# EAGLE design Principal (EAGLE 7.6.0)
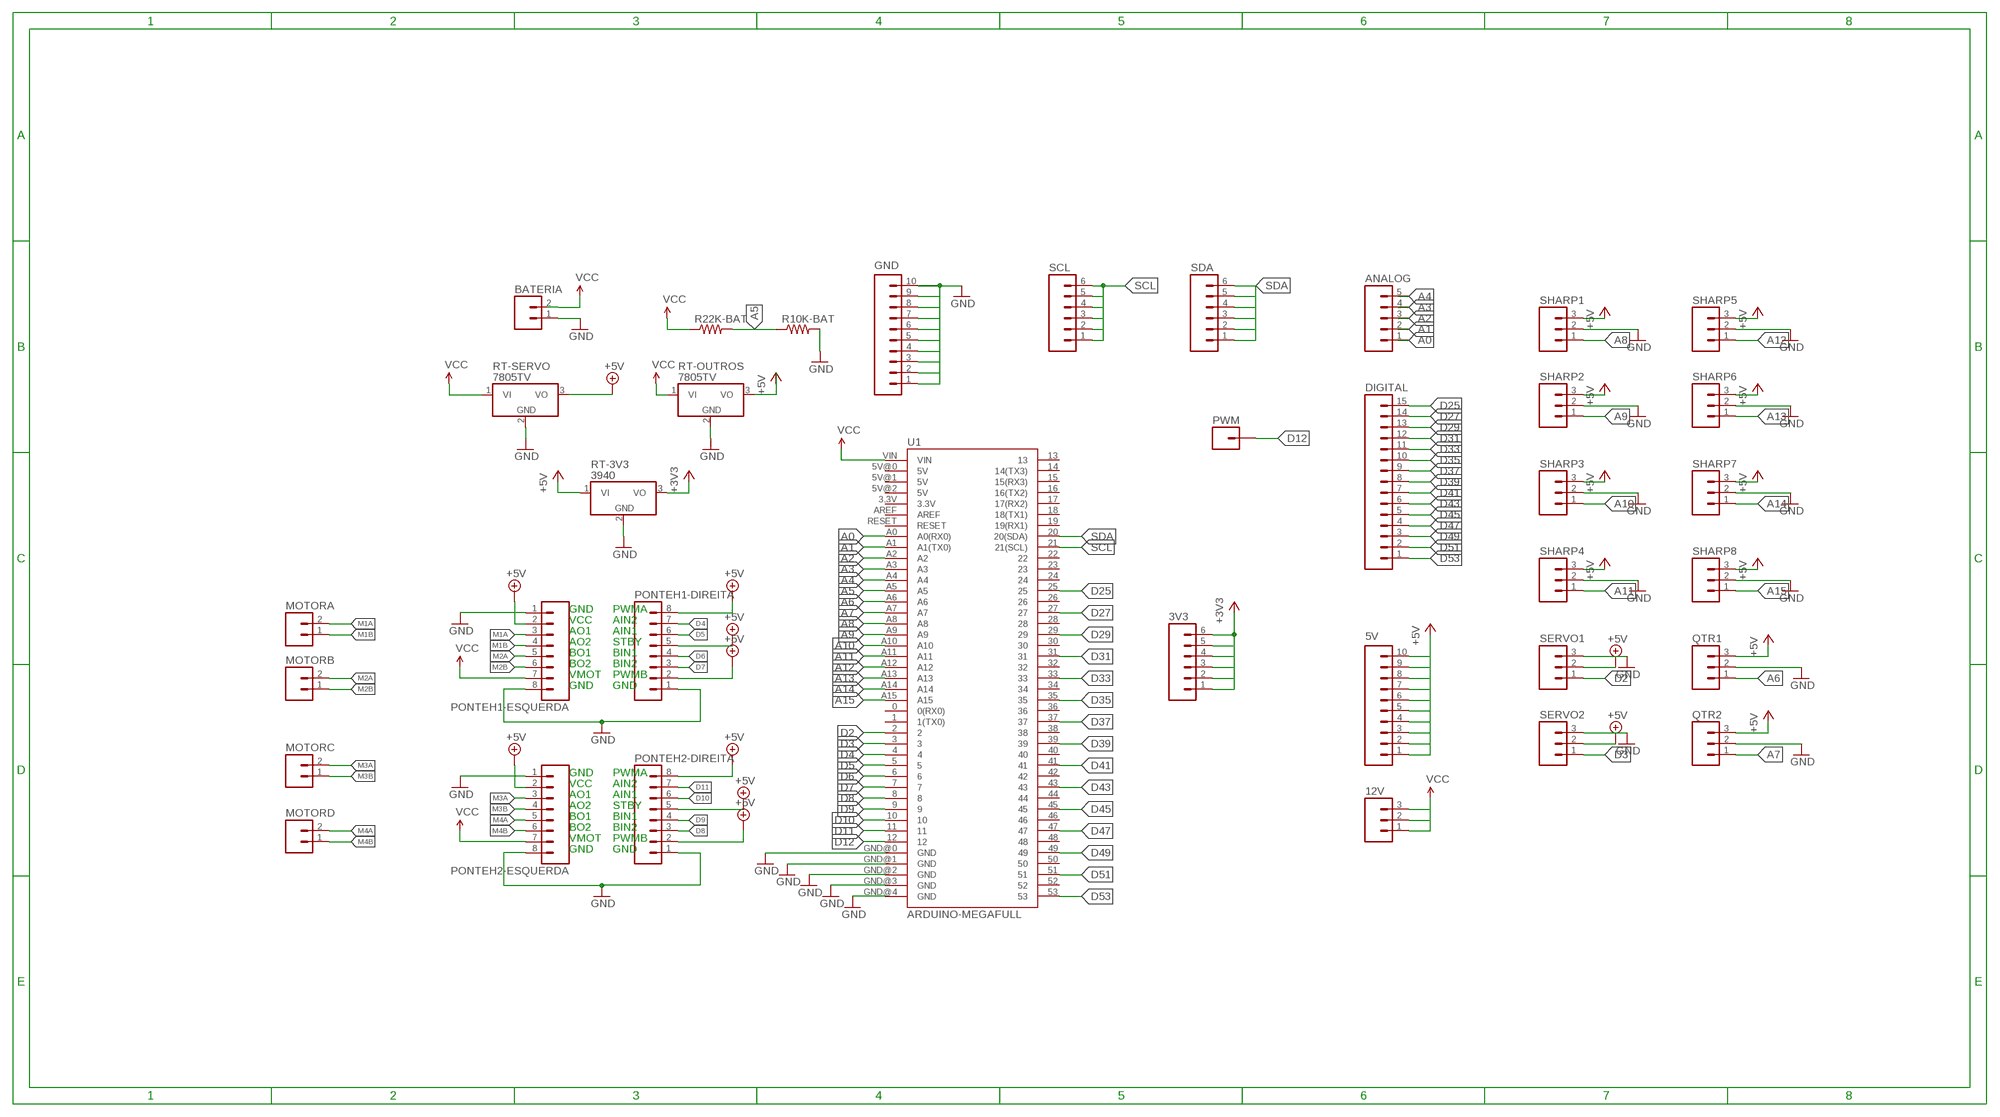
[diagram p0: schematic, sheet 1]

## Parts
3V3  M06SILK_FEMALE_PTH  [1X06]
5V  M10SILK_FEMALE_PTH  [1X10]
12V  M03PTH  [1X03]
ANALOG  M05PTH  [1X05]
BATERIA  M02PTH  [1X02]
DIGITAL  M15  [1X15]
GND  M10SILK_FEMALE_PTH  [1X10]
MOTORA  M02PTH  [1X02]
MOTORB  M02PTH  [1X02]
MOTORC  M02PTH  [1X02]
MOTORD  M02PTH  [1X02]
PONTEH1-DIREITA  M08  [1X08_ROUND]
PONTEH1-ESQUERDA  M08  [1X08_ROUND]
PONTEH2-DIREITA  M08  [1X08_ROUND]
PONTEH2-ESQUERDA  M08  [1X08_ROUND]
PWM  M01PTH  [1X01]
QTR1  M03PTH  [1X03]
QTR2  M03PTH  [1X03]
R10K-BAT  RESISTORPTH-1/4W  [AXIAL-0.4]
R22K-BAT  RESISTORPTH-1/4W  [AXIAL-0.4]
RT-3V3  3940  7805TV  [TO220V]
RT-OUTROS  7805TV  [TO220V]
RT-SERVO  7805TV  [TO220V]
SCL  M06SILK_FEMALE_PTH  [1X06]
SDA  M06SILK_FEMALE_PTH  [1X06]
SERVO1  M03PTH  [1X03]
SERVO2  M03PTH  [1X03]
SHARP1  M03PTH  [1X03]
SHARP2  M03PTH  [1X03]
SHARP3  M03PTH  [1X03]
SHARP4  M03PTH  [1X03]
SHARP5  M03PTH  [1X03]
SHARP6  M03PTH  [1X03]
SHARP7  M03PTH  [1X03]
SHARP8  M03PTH  [1X03]
U1  ARDUINO-MEGAFULL  [ARDUINO_MEGA]

## Nets
3V3: 3V3.2 3V3.3 3V3.4 3V3.5 RT-3V3.3(VO) ; supply symbol labelled +3V3
5V: 5V.2 5V.3 5V.4 5V.5 5V.6 5V.7 5V.8 5V.9 5V.10 RT-OUTROS.3(VO) ; supply symbol labelled +5V
+3V3: 3V3.1 3V3.6
+5V: 5V.1 PONTEH1-DIREITA.2 PONTEH1-DIREITA.5 PONTEH1-DIREITA.8 PONTEH1-ESQUERDA.2 PONTEH2-DIREITA.2 PONTEH2-DIREITA.5 PONTEH2-DIREITA.8 PONTEH2-ESQUERDA.2 QTR1.3 QTR2.3 RT-3V3.1(VI) RT-SERVO.3(VO) SERVO1.2 SERVO2.2 SHARP1.3 SHARP2.3 SHARP3.3 SHARP4.3 SHARP5.3 SHARP6.3 SHARP7.3 SHARP8.3
A0: ANALOG.1 U1.A0(A0(RX0))
A1: ANALOG.2 U1.A1(A1(TX0))
A2: ANALOG.3 U1.A2
A3: ANALOG.4 U1.A3
A4: ANALOG.5 U1.A4
A5: R10K-BAT.P$1 R22K-BAT.P$2 U1.A5
A6: QTR1.1 U1.A6
A7: QTR2.1 U1.A7
A8: SHARP1.1 U1.A8
A9: SHARP2.1 U1.A9
A10: SHARP3.1 U1.A10
A11: SHARP4.1 U1.A11
A12: SHARP5.1 U1.A12
A13: SHARP6.1 U1.A13
A14: SHARP7.1 U1.A14
A15: SHARP8.1 U1.A15
D2: SERVO1.1 U1.2
D3: SERVO2.1 U1.3
D4: PONTEH1-DIREITA.7 U1.4
D5: PONTEH1-DIREITA.6 U1.5
D6: PONTEH1-DIREITA.4 U1.6
D7: PONTEH1-DIREITA.3 U1.7
D8: PONTEH2-DIREITA.3 U1.8
D9: PONTEH2-DIREITA.4 U1.9
D10: PONTEH2-DIREITA.6 U1.10
D11: PONTEH2-DIREITA.7 U1.11
D12: PWM.1 U1.12
D25: DIGITAL.15 U1.25
D27: DIGITAL.14 U1.27
D29: DIGITAL.13 U1.29
D31: DIGITAL.12 U1.31
D33: DIGITAL.11 U1.33
D35: DIGITAL.10 U1.35
D37: DIGITAL.9 U1.37
D39: DIGITAL.8 U1.39
D41: DIGITAL.7 U1.41
D43: DIGITAL.6 U1.43
D45: DIGITAL.5 U1.45
D47: DIGITAL.4 U1.47
D49: DIGITAL.3 U1.49
D51: DIGITAL.2 U1.51
D53: DIGITAL.1 U1.53
GND: BATERIA.1 GND.1 GND.10 PONTEH1-DIREITA.1 PONTEH1-ESQUERDA.1 PONTEH1-ESQUERDA.8 PONTEH2-DIREITA.1 PONTEH2-ESQUERDA.1 PONTEH2-ESQUERDA.8 QTR1.2 QTR2.2 R10K-BAT.P$2 RT-3V3.2(GND) RT-OUTROS.2(GND) RT-SERVO.2(GND) SERVO1.3 SERVO2.3 SHARP1.2 SHARP2.2 SHARP3.2 SHARP4.2 SHARP5.2 SHARP6.2 SHARP7.2 SHARP8.2 U1.GND@0(GND) U1.GND@1(GND) U1.GND@2(GND) U1.GND@3(GND) U1.GND@4(GND)
M1A: MOTORA.2 PONTEH1-ESQUERDA.3
M1B: MOTORA.1 PONTEH1-ESQUERDA.4
M2A: MOTORB.2 PONTEH1-ESQUERDA.5
M2B: MOTORB.1 PONTEH1-ESQUERDA.6
M3A: MOTORC.2 PONTEH2-ESQUERDA.3
M3B: MOTORC.1 PONTEH2-ESQUERDA.4
M4A: MOTORD.2 PONTEH2-ESQUERDA.5
M4B: MOTORD.1 PONTEH2-ESQUERDA.6
N$2: GND.9
N$3: GND.8
N$4: GND.7
N$5: GND.6
N$6: GND.5
N$7: GND.4
N$8: GND.3
N$9: GND.2
SCL: SCL.1 SCL.2 SCL.3 SCL.4 SCL.5 SCL.6 U1.21(21(SCL))
SDA: SDA.1 SDA.2 SDA.3 SDA.4 SDA.5 SDA.6 U1.20(20(SDA))
VCC: 12V.1 12V.2 12V.3 BATERIA.2 PONTEH1-ESQUERDA.7 PONTEH2-ESQUERDA.7 R22K-BAT.P$1 RT-OUTROS.1(VI) RT-SERVO.1(VI) U1.VIN
Unconnected: U1.0(0(RX0)) U1.1(1(TX0)) U1.3.3V U1.5V@0(5V) U1.5V@1(5V) U1.5V@2(5V) U1.13 U1.14(14(TX3)) U1.15(15(RX3)) U1.16(16(TX2)) U1.17(17(RX2)) U1.18(18(TX1)) U1.19(19(RX1)) U1.22 U1.23 U1.24 U1.26 U1.28 U1.30 U1.32 U1.34 U1.36 U1.38 U1.40 U1.42 U1.44 U1.46 U1.48 U1.50 U1.52 U1.AREF U1.RESET

## Notes on the sheet
- GND | PWMA
- VCC | AIN2
- AO1 | AIN1
- AO2 | STBY
- BO1 | BIN1
- BO2 | BIN2
- VMOT | PWMB
- GND | GND
- GND | PWMA
- VCC | AIN2
- AO1 | AIN1
- AO2 | STBY
- BO1 | BIN1
- BO2 | BIN2
- VMOT | PWMB
- GND | GND

## Library data of the parts
3V3 SCL SDA = SparkFun-Connectors:M06: Header 6 Standard 6-pin 0.1" header. Use with straight break away headers (SKU : PRT-00116), right angle break away headers (PRT-00553), swiss pins (PRT-00743), machine pins (PRT-00117), and female headers (PRT-00115). Molex polarized connector foot print use with SKU : PRT-08094 with associated crimp pins and housings. NOTES ON THE VARIANTS LOCK and LOCK_LONGPADS... This footprint was designed to help hold the alignment of a through-hole component (i.e. 6-pin header) while soldering it into place. You may notice that each hole has been shifted either up or down by 0.005 of an inch from it's more standard position (which is a perfectly straight line). This slight alteration caused the pins (the squares in the middle) to touch the edges of the holes. Because they are alternating, it causes a "brace" to hold the component in place. 0.005 has proven to be the perfect amount of "off-center" position when using our standard breakaway headers. Although looks a little odd when you look at the bare footprint, once you have a header in there, the alteration is very hard to notice. Also,if you push a header all the way into place, it is covered up entirely on the bottom side. This idea of altering the position of holes to aid alignment will be further integrated into the Sparkfun Library for other footprints. It can help hold any component with 3 or more connection pins.; PROD_ID: CONN-08437
5V GND = SparkFun-Connectors:M10: Header 10 Standard 10-pin 0.1" header. Use with straight break away headers (SKU : PRT-00116), right angle break away headers (PRT-00553), swiss pins (PRT-00743), machine pins (PRT-00117), and female headers (PRT-00115).; PROD_ID: CONN-11563
12V QTR1 QTR2 SERVO1 SERVO2 SHARP1-SHARP8 = SparkFun-Connectors:M03: Header 3 Standard 3-pin 0.1" header. Use with straight break away headers (SKU : PRT-00116), right angle break away headers (PRT-00553), swiss pins (PRT-00743), machine pins (PRT-00117), and female headers (PRT-00115). Molex polarized connector foot print use with SKU : PRT-08232 with associated crimp pins and housings.
ANALOG = SparkFun-Connectors:M05: Header 5 Standard 5-pin 0.1" header. Use with straight break away headers (SKU : PRT-00116), right angle break away headers (PRT-00553), swiss pins (PRT-00743), machine pins (PRT-00117), and female headers (PRT-00115). Molex polarized connector foot print use with SKU : PRT-08230 with associated crimp pins and housings.
BATERIA MOTORA MOTORB MOTORC MOTORD = SparkFun-Connectors:M02: Standard 2-pin 0.1" header. Use with - straight break away headers ( PRT-00116) - right angle break away headers (PRT-00553) - swiss pins (PRT-00743) - machine pins (PRT-00117) - female headers (PRT-00115) Molex polarized connector foot print use with: PRT-08233 with associated crimp pins and housings. 2.54_SCREWTERM for use with PRT-10571. 3.5mm Screw Terminal footprints for PRT-08084 5mm Screw Terminal footprints for use with PRT-08432
DIGITAL = SparkFun-Connectors:M15: Header 15 Standard 15-pin 0.1" header. Use with straight break away headers (SKU : PRT-00116), right angle break away headers (PRT-00553), swiss pins (PRT-00743), machine pins (PRT-00117), and female headers (PRT-00115).
PONTEH1-DIREITA PONTEH1-ESQUERDA PONTEH2-DIREITA PONTEH2-ESQUERDA = SparkFun-Connectors:M08: Header 8 Standard 8-pin 0.1" header. Use with straight break away headers (SKU : PRT-00116), right angle break away headers (PRT-00553), swiss pins (PRT-00743), machine pins (PRT-00117), and female headers (PRT-00115).; PROD_ID: CONN-08437
PWM = SparkFun-Connectors:M01: Header 1 Standard 1-pin 0.1" header. Use with straight break away headers (SKU : PRT-00116), right angle break away headers (PRT-00553), swiss pins (PRT-00743), machine pins (PRT-00117), and female headers (PRT-00115). SMTSO-256-ET is a "flush mount" nut for a 4-40 screw. The older package used to be too tight, and did not allow it to sit properly thru the drill hit. The latest (0.165DIA) fits nice and snug.
R10K-BAT R22K-BAT = SparkFun-Passives:RESISTOR: Resistor Basic schematic elements and footprints for 0603, 1206, and PTH resistors.
RT-3V3 RT-OUTROS RT-SERVO = linear:78*: Positive VOLTAGE REGULATOR Source: http://cache.national.com/ds/LM/LM78L05.pdf http://www.fairchildsemi.com/ds/LM/LM7805.pdf
U1 = SparkFun-Boards:ARDUINO-MEGA: Arduino Mega board footprint

## Board
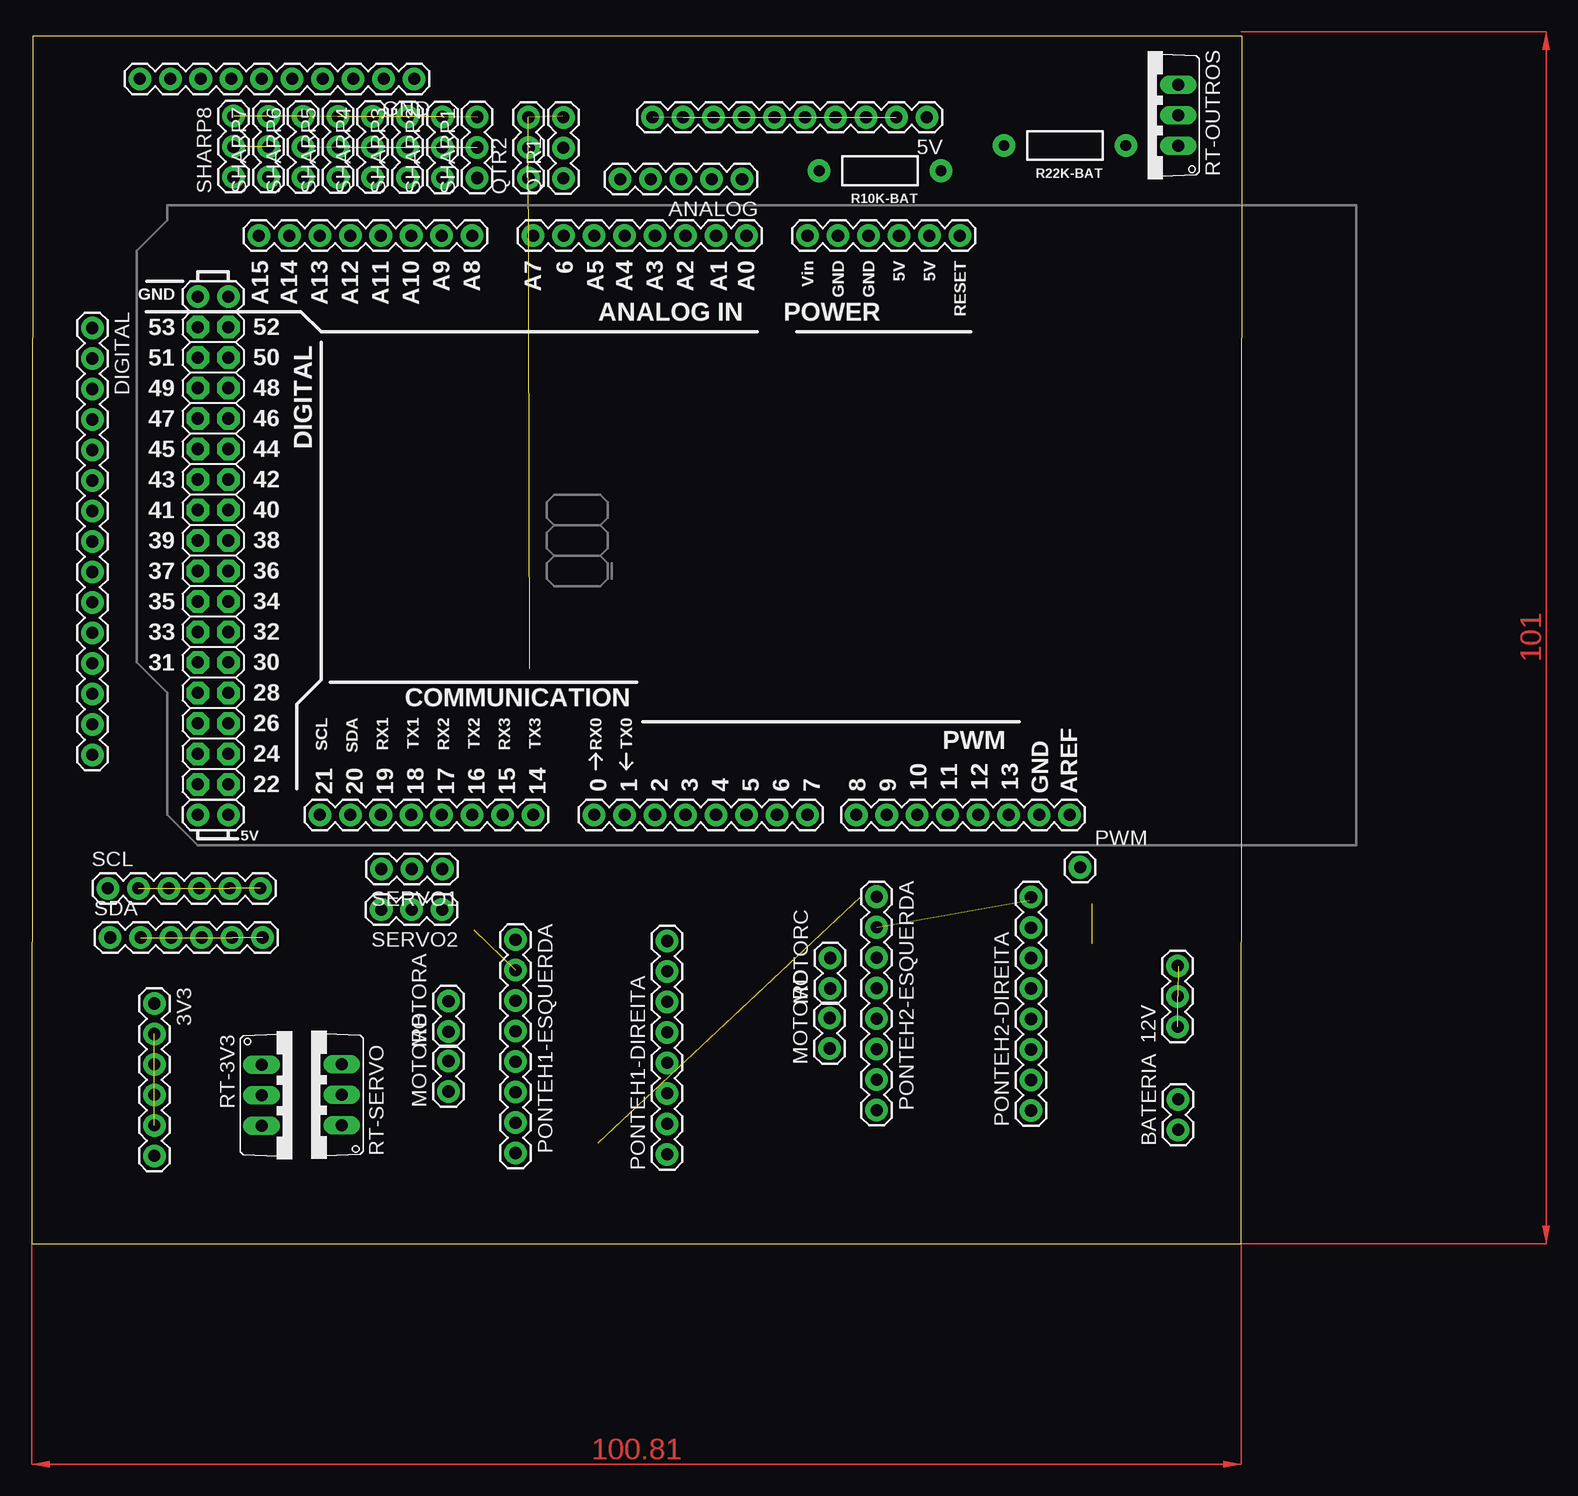
[diagram p1: board, top side]
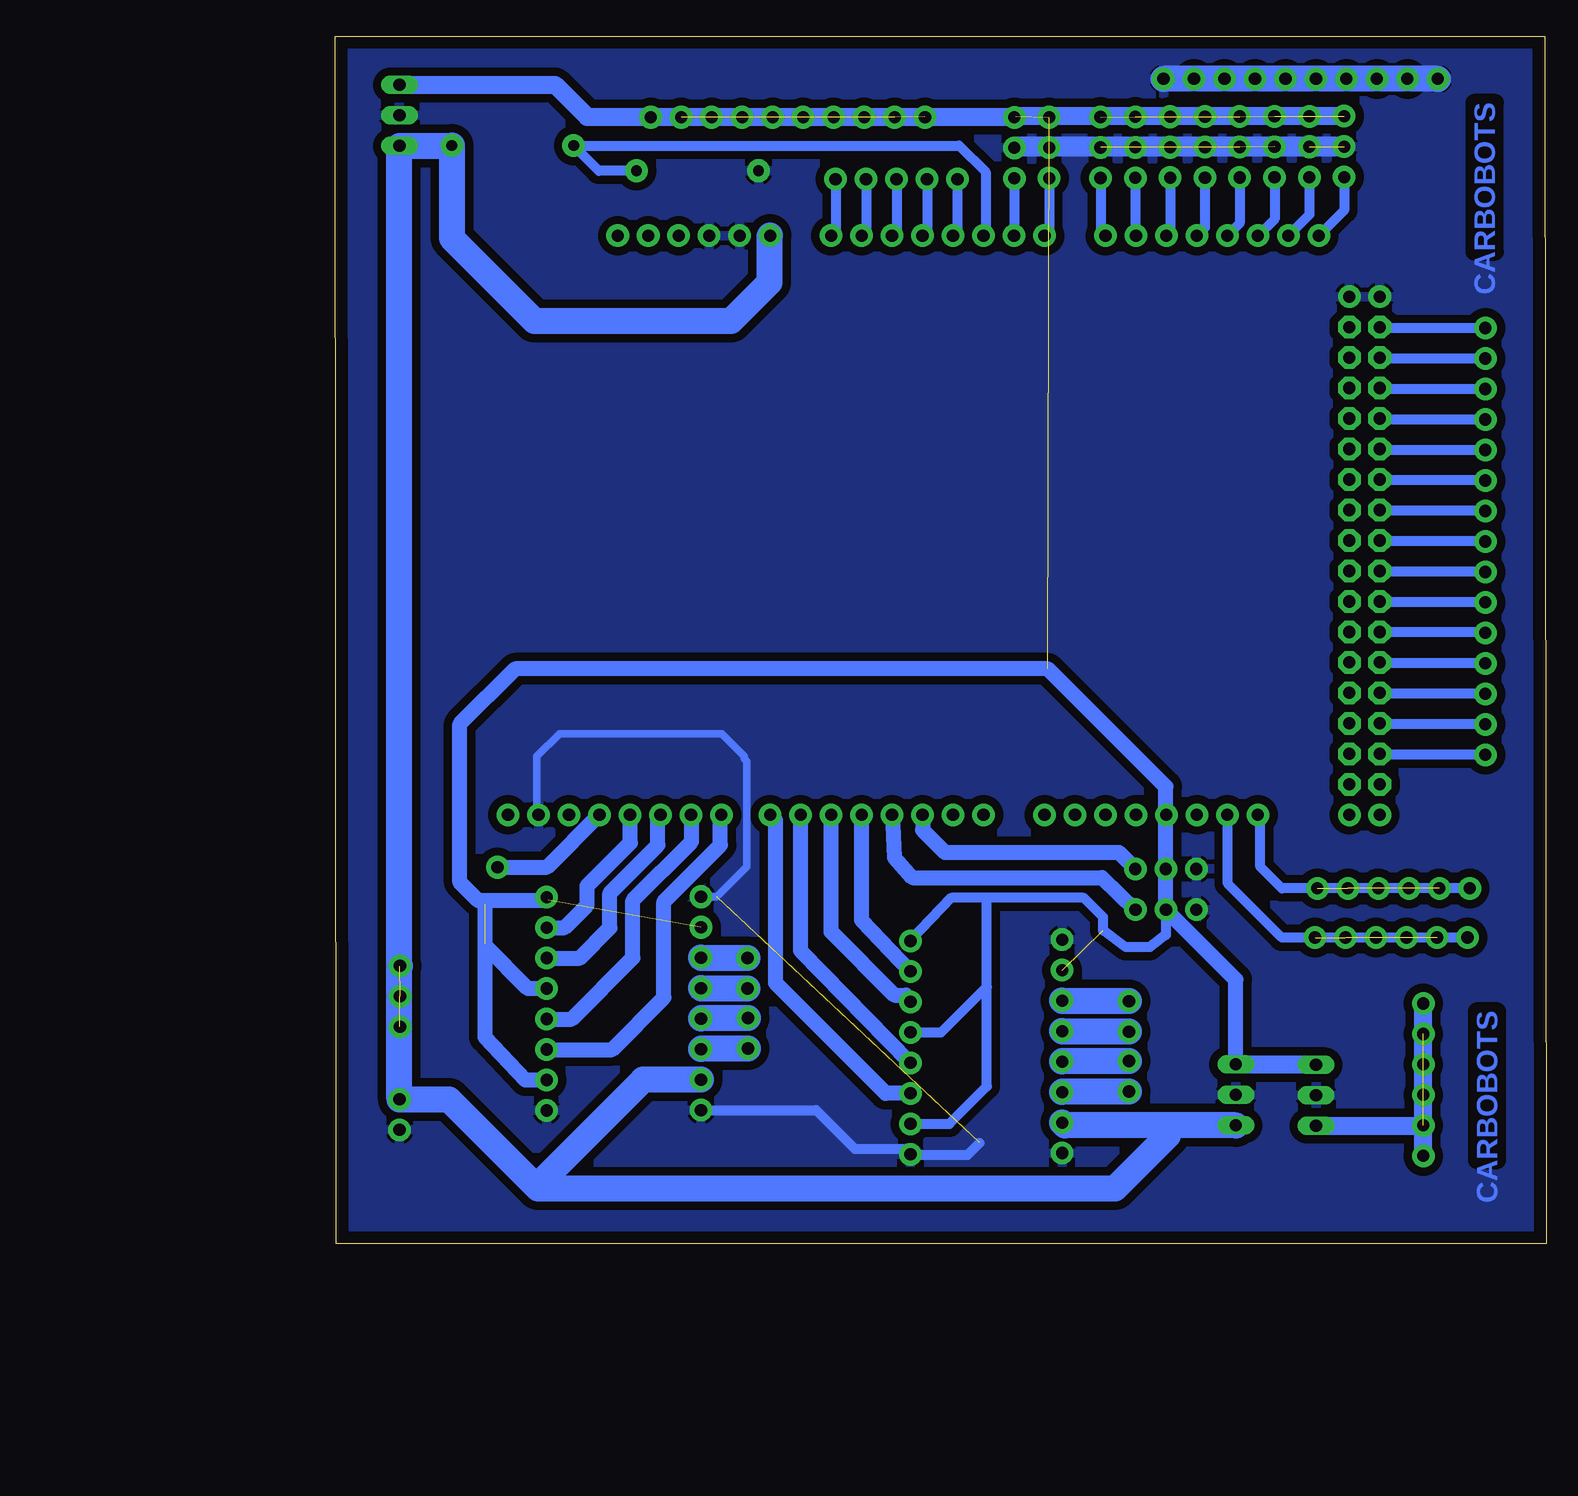
[diagram p2: board, bottom side, seen from below]

Size 100.91 x 100.6 mm. Coordinates in mm from the lower left corner, seen from the top.
Outline: 0,0 100.81,0 100.91,100.6 0.1,100.6 0,0
Copper layers (1*16): Top 0.035mm / dielectric 1.5mm / Bottom 0.035mm
Design rules "default": minimum track width 10mil, minimum drill 24mil, track to track 8mil, track to pad 8mil, pad to pad 8mil, via to via 8mil, smd to smd 8mil, copper to edge 40mil, drill to drill 8mil, minimum pad ring 10mil, minimum via ring 8mil, stop-mask expansion 4mil, vias tented up to drill 0mil, thermal gap 10mil

### Footprints (pad centres in the part's own frame; a part is rotated, then mirrored left to right if it is on the bottom)
1X06 = drill 1.016 pad 1.88: 1 0,0; 2 2.54,0; 3 5.08,0; 4 7.62,0; 5 10.16,0; 6 12.7,0
1X10 = drill 1.016 pad 1.88: 1 0,0; 2 2.54,0; 3 5.08,0; 4 7.62,0; 5 10.16,0; 6 12.7,0; 7 15.24,0; 8 17.78,0; 9 20.32,0; 10 22.86,0
1X03 = drill 1.016 pad 1.88: 1 0,0; 2 2.54,0; 3 5.08,0
1X05 = drill 1.016 pad 1.88: 1 0,0; 2 2.54,0; 3 5.08,0; 4 7.62,0; 5 10.16,0
1X02 = drill 1.016 pad 1.88: 1 0,0; 2 2.54,0
1X15 = drill 1.016 pad 1.88: 1 0,0; 2 2.54,0; 3 5.08,0; 4 7.62,0; 5 10.16,0; 6 12.7,0; 7 15.24,0; 8 17.78,0; 9 20.32,0; 10 22.86,0; 11 25.4,0; 12 27.94,0; 13 30.48,0; 14 33.02,0; 15 35.56,0
1X08_ROUND = drill 1.016 pad 1.88: 1 0,0; 2 2.54,0; 3 5.08,0; 4 7.62,0; 5 10.16,0; 6 12.7,0; 7 15.24,0; 8 17.78,0
1X01 = drill 1.016 pad 1.88: 1 0,0
AXIAL-0.4 = drill 0.9 pad 1.88: P$1 -5.08,0; P$2 5.08,0
TO220V = drill 1.016 long: 1 -2.54,-2.54; 2 0,-2.54; 3 2.54,-2.54
ARDUINO_MEGA = drill 1.016 pad 1.88: 0 63.5,50.8; 1 60.96,50.8; 2 58.42,50.8; 3 55.88,50.8; 3.3V 35.56,2.54; 4 53.34,50.8; 5 50.8,50.8; 5V@0 38.1,2.54; 5V@1 93.98,50.8; 5V@2 96.52,50.8; 6 48.26,50.8; 7 45.72,50.8; 8 41.656,50.8; 9 39.116,50.8; 10 36.576,50.8; 11 34.036,50.8; 12 31.496,50.8; 13 28.956,50.8; 14 68.58,50.8; 15 71.12,50.8; 16 73.66,50.8; 17 76.2,50.8; 18 78.74,50.8; 19 81.28,50.8; 20 83.82,50.8; 21 86.36,50.8; A0 50.8,2.54; A1 53.34,2.54; A2 55.88,2.54; A3 58.42,2.54; A4 60.96,2.54; A5 63.5,2.54; A6 66.04,2.54; A7 68.58,2.54; A8 73.66,2.54; A9 76.2,2.54; A10 78.74,2.54; A11 81.28,2.54; A12 83.82,2.54; A13 86.36,2.54; A14 88.9,2.54; A15 91.44,2.54; AREF 23.876,50.8; GND@0 40.64,2.54; GND@1 43.18,2.54; GND@2 93.98,7.62; GND@3 96.52,7.62; GND@4 26.416,50.8; RESET 33.02,2.54; VIN 45.72,2.54 | drill 1.016 pad 1.88 octagon: 22 93.98,48.26; 23 96.52,48.26; 24 93.98,45.72; 25 96.52,45.72; 26 93.98,43.18; 27 96.52,43.18; 28 93.98,40.64; 29 96.52,40.64; 30 93.98,38.1; 31 96.52,38.1; 32 93.98,35.56; 33 96.52,35.56; 34 93.98,33.02; 35 96.52,33.02; 36 93.98,30.48; 37 96.52,30.48; 38 93.98,27.94; 39 96.52,27.94; 40 93.98,25.4; 41 96.52,25.4; 42 93.98,22.86; 43 96.52,22.86; 44 93.98,20.32; 45 96.52,20.32; 46 93.98,17.78; 47 96.52,17.78; 48 93.98,15.24; 49 96.52,15.24; 50 93.98,12.7; 51 96.52,12.7; 52 93.98,10.16; 53 96.52,10.16

### Placement (x,y rotation side)
3V3  10.23,20.01 270 top
5V  74.61,93.86 180 top
12V  95.51,18.06 90 top
ANALOG  59.21,88.7 180 top
BATERIA  95.55,9.48 90 top
DIGITAL  5.06,76.29 270 top
GND  31.88,97.06 180 top
MOTORA  34.75,17.66 90 top
MOTORB  34.75,12.67 90 top
MOTORC  66.55,21.25 90 top
MOTORD  66.51,16.25 90 top
PONTEH1-DIREITA  52.97,7.44 90 top
PONTEH1-ESQUERDA  40.33,25.32 270 top
PONTEH2-DIREITA  83.29,11.09 90 top
PONTEH2-ESQUERDA  70.43,28.9 270 top
PWM  87.38,31.36 0 top
QTR1  44.31,88.77 90 top
QTR2  41.41,88.78 90 top
R10K-BAT  70.71,89.4 180 top
R22K-BAT  86.11,91.5 180 top
RT-3V3  21.71,12.35 270 top
RT-OUTROS  93.01,94.02 90 top
RT-SERVO  23.31,12.39 90 top
SCL  6.36,29.6 0 top
SDA  6.55,25.5 0 top
SERVO1  34.23,31.22 180 top
SERVO2  34.22,27.82 180 top
SHARP1  37.13,88.8 90 top
SHARP2  34.23,88.81 90 top
SHARP3  31.33,88.82 90 top
SHARP4  28.43,88.83 90 top
SHARP5  25.53,88.84 90 top
SHARP6  22.63,88.85 90 top
SHARP7  19.73,88.86 90 top
SHARP8  16.83,88.87 90 top
U1  110.38,86.53 180 top

### Tracks (layer width: path | path; a pad name or v marks a point on that pad's centre or on a via)
3V3  (3 unrouted)
  Bottom 0.813: 10.27,9.81 3V3.5
  Bottom 1.5: RT-3V3.3 10.27,9.81
5V  (8 unrouted)
  Bottom 0.813: 51.79,93.9 5V.10
  Bottom 1.5: RT-OUTROS.3 82.57,96.56 79.91,93.9 51.79,93.9
+3V3
  Bottom 1.5: 3V3.6 3V3.1
+5V  (12 unrouted)
  Bottom 0.813: 44.21,93.95 QTR1.3 | 5V.1 | 19.21,14.93 RT-3V3.1 | SERVO2.2 31.68,25.73 33.01,24.7 35.01,24.7 36.91,26.1 36.91,27.2 38.51,28.8 46.61,28.8 | 46.61,28.8 49.59,28.8 PONTEH1-DIREITA.8 | PONTEH1-DIREITA.5 50.41,17.6 46.61,21.4 | 46.61,21.4 46.61,28.8 | PONTEH1-DIREITA.2 49.73,9.98 46.61,13.1 46.61,21.4
  Bottom 1.27: 88.11,28.6 89.01,28.6 90.51,30.1 90.51,43.3 85.91,47.9 41.51,47.9 31.69,38.08 SERVO1.2 SERVO2.2 25.85,21.99 RT-SERVO.3 | 88.11,28.6 83.16,28.6 PONTEH2-DIREITA.8 | PONTEH2-DIREITA.5 84.86,21.25 88.41,24.8 88.41,25 | 88.11,28.6 88.41,28.3 88.41,17.2 85.04,13.63 PONTEH2-DIREITA.2
  Bottom 1.5: SHARP8.3 44.21,93.95 | QTR1.3 5V.1 | RT-SERVO.3 19.21,14.93
A0
  Bottom 0.813: ANALOG.1 59.21,84.36 U1.A0
A1
  Bottom 0.813: ANALOG.2 56.67,84.36 U1.A1
A2
  Bottom 0.813: ANALOG.3 54.13,84.36 U1.A2
A3
  Bottom 0.813: ANALOG.4 51.59,84.36 U1.A3
A4
  Bottom 0.813: ANALOG.5 49.05,84.36 U1.A4
A5
  Bottom 0.813: U1.A5 46.71,84.16 46.71,89.3 48.91,91.5 R22K-BAT.P$2 78.93,89.4 R10K-BAT.P$1
A6
  Bottom 0.813: QTR1.1 44.31,84.02 U1.A6
A7
  Bottom 0.813: QTR2.1 41.41,84.38 U1.A7
A8
  Bottom 0.813: SHARP1.1 37.13,84.4 U1.A8
A9
  Bottom 0.813: SHARP2.1 34.23,84.04 U1.A9
A10
  Bottom 0.813: SHARP3.1 31.33,84.3 U1.A10
A11
  Bottom 0.813: SHARP4.1 28.43,84.66 U1.A11
A12
  Bottom 0.813: SHARP5.1 25.53,85.02 U1.A12
A13
  Bottom 0.813: SHARP6.1 22.63,85.38 U1.A13
A14
  Bottom 0.813: SHARP7.1 19.73,85.74 U1.A14
A15
  Bottom 0.813: SHARP8.1 16.83,86.1 U1.A15
D2
  Bottom 1.27: U1.2 51.96,34.45 50.11,32.6 35.61,32.6 SERVO1.1
D3
  Bottom 1.27: U1.3 54.3,32.19 52.81,30.5 37,30.5 SERVO2.1
D4
  Bottom 1.27: PONTEH1-DIREITA.7 57.04,26.95 U1.4
D5
  Bottom 1.27: U1.5 59.58,25.97 54.31,20.7 53.33,20.7 PONTEH1-DIREITA.6
D6
  Bottom 1.27: PONTEH1-DIREITA.4 62.12,24.41 U1.6
D7
  Bottom 1.27: PONTEH1-DIREITA.3 55.03,12.52 64.21,21.7 64.21,35.28 U1.7
D8
  Bottom 1.27: PONTEH2-DIREITA.3 77.84,16.17 73.51,20.5 73.51,28.5 68.81,33.2 68.81,35.64 U1.8
D9
  Bottom 1.27: PONTEH2-DIREITA.4 81.2,18.71 76.11,23.8 76.11,28.6 71.21,33.5 71.21,35.68 U1.9
D10
  Bottom 1.27: PONTEH2-DIREITA.6 80.52,23.79 78.01,26.3 78.01,29.2 74.01,33.2 74.01,35.52 U1.10
D11
  Bottom 1.27: PONTEH2-DIREITA.7 81.78,26.33 79.91,28.2 79.91,29.8 76.31,33.4 76.31,35.7 U1.11
D12
  Bottom 1.27: PWM.1 83.25,31.36 U1.12
D25
  Bottom 0.813: DIGITAL.15 13.78,40.73 U1.25
D27
  Bottom 0.813: DIGITAL.14 13.78,43.27 U1.27
D29
  Bottom 0.813: DIGITAL.13 13.78,45.81 U1.29
D31
  Bottom 0.813: DIGITAL.12 13.78,48.35 U1.31
D33
  Bottom 0.813: U1.33 5.14,50.97 DIGITAL.11
D35
  Bottom 0.813: DIGITAL.10 13.78,53.43 U1.35
D37
  Bottom 0.813: DIGITAL.9 13.78,55.97 U1.37
D39
  Bottom 0.813: DIGITAL.8 13.78,58.51 U1.39
D41
  Bottom 0.813: DIGITAL.7 13.78,61.05 U1.41
D43
  Bottom 0.813: DIGITAL.6 13.78,63.59 U1.43
D45
  Bottom 0.813: DIGITAL.5 13.78,66.13 U1.45
D47
  Bottom 0.813: DIGITAL.4 13.78,68.67 U1.47
D49
  Bottom 0.813: DIGITAL.3 13.78,71.21 U1.49
D51
  Bottom 0.813: DIGITAL.2 13.78,73.75 U1.51
D53
  Bottom 0.813: DIGITAL.1 13.78,76.29 U1.53
GND  (7 unrouted)
  Bottom 0.406: SHARP7.2 | SHARP6.2 | SHARP5.2 | SHARP4.2 | SHARP3.2 | SHARP2.2 | QTR1.2
  Bottom 0.61: PONTEH2-ESQUERDA.1 69.11,28.9 66.61,31.4 66.61,40.2 66.81,40.4 66.81,40.6 68.71,42.5 82.21,42.5 84.11,40.6 84.11,35.88 U1.GND@4
  Bottom 0.813: PONTEH2-ESQUERDA.8 60.83,11.12 57.61,7.9 53.51,7.9 53.01,7.4 48.21,7.4 47.21,8.4
  Bottom 1.016: 44.31,91.41 QTR1.2
  Bottom 1.676: SHARP8.2 44.31,91.41
  Bottom 2.184: GND.10 GND.1
  pour Bottom (isolate 0.7): 0.31,100.6 100.71,100.6 100.71,-0.1 0.31,-0.1
M1A
  Bottom 2.184: MOTORA.2 40.29,20.2 PONTEH1-ESQUERDA.3
M1B
  Bottom 2.184: MOTORA.1 40.29,17.66 PONTEH1-ESQUERDA.4
M2A
  Bottom 2.184: MOTORB.2 40.28,15.21 PONTEH1-ESQUERDA.5
M2B
  Bottom 2.184: MOTORB.1 40.28,12.67 PONTEH1-ESQUERDA.6
M3A
  Bottom 2.184: MOTORC.2 70.4,23.79 PONTEH2-ESQUERDA.3
M3B
  Bottom 2.184: MOTORC.1 70.4,21.25 PONTEH2-ESQUERDA.4
M4A
  Bottom 2.184: MOTORD.2 70.38,18.79 PONTEH2-ESQUERDA.5
M4B
  Bottom 2.184: MOTORD.1 70.38,16.25 PONTEH2-ESQUERDA.6
SCL  (4 unrouted)
  Bottom 0.813: SCL.1 SCL.6 22.01,29.6 23.81,31.4 23.81,35.52 U1.21
SDA  (4 unrouted)
  Bottom 0.813: SDA.1 SDA.6 22.01,25.5 26.51,30 26.51,35.68 U1.20
VCC  (2 unrouted)
  Bottom 2.184: 95.55,23.1 BATERIA.2 91.43,12.02 84.16,4.75 | 95.55,23.1 12V.3 | 95.55,23.1 RT-OUTROS.1 91.21,91.48 R22K-BAT.P$1 91.19,83.78 84.31,76.9 67.91,76.9 64.71,80.1 64.71,83.94 U1.VIN | RT-SERVO.1 31.71,9.85 | 31.71,9.85 40.1,9.85 PONTEH1-ESQUERDA.7 | 84.16,4.75 84.01,4.6 35.91,4.6 31.51,9 31.51,9.65 31.71,9.85 | PONTEH2-ESQUERDA.7 75.25,13.66 84.16,4.75
(copper drawn outside any net)
  shapes: Top area x4

### Text on the board
Bottom: CARBOBOTS | CARBOBOTS